# Altium schematic sheet SpeedACQ.SchDoc: SpeedACQ
size A4; Author: Joao Guimaraes; Organization: Altium Limited; Address1: L3, 12a Rodborough Rd; Address2: Frenchs Forest; Address3: NSW; Address4: Australia 2086; Revision: 1.0.0
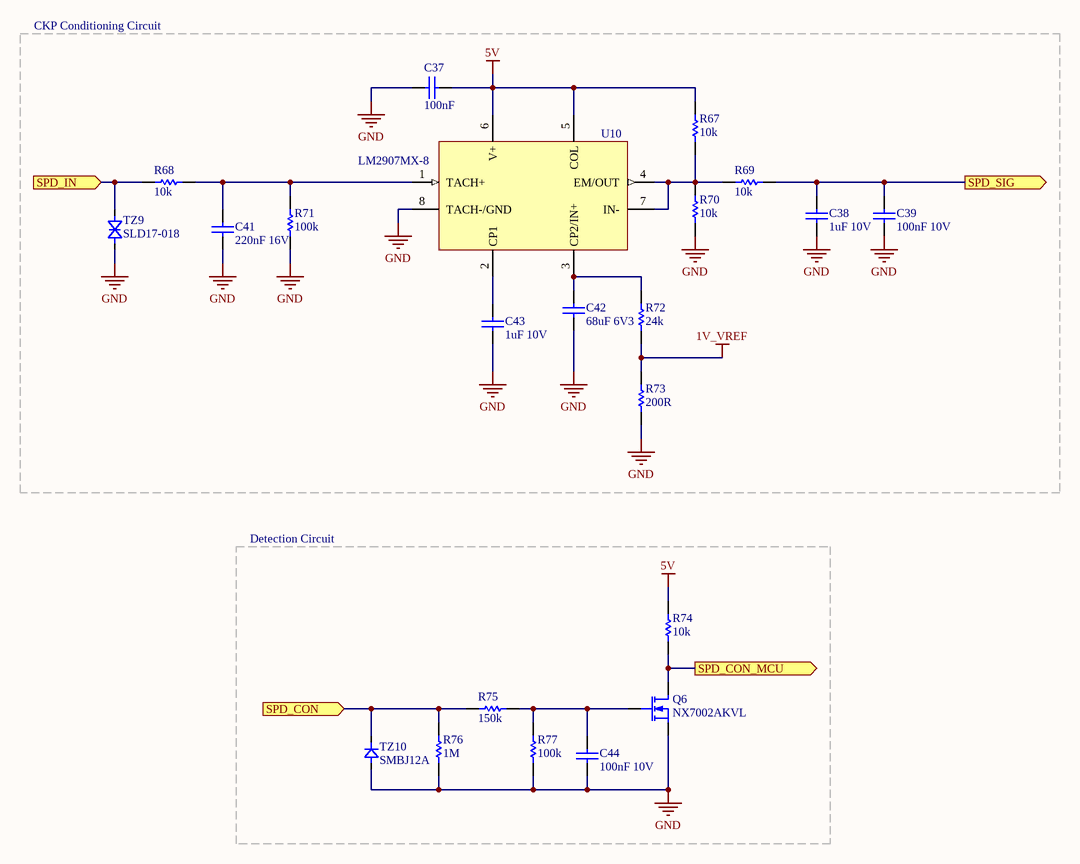
[diagram p0: SpeedACQ.SchDoc]

## Parts
C37  100nF  [0402]
C38  1uF 10V  [C0805]
C39  100nF 10V  [0402]
C41  220nF 16V  [0402]
C42  68uF 6V3  [C0805]
C43  1uF 10V  [C0805]
C44  100nF 10V  [0402]
Q6  NX7002AKVL  [SOT23_M]
R67  10k  [6-0805_M]
R68  10k  [6-0805_M]
R69  10k  [6-0805_M]
R70  10k  [6-0805_M]
R71  100k  [6-0805_M]
R72  24k  [6-0805_M]
R73  200R  [6-0805_M]
R74  10k  [6-0805_M]
R75  150k  [6-0805_M]
R76  1M  [6-0805_M]
R77  100k  [6-0805_M]
TZ9  SLD17-018  [PIN-W2/E2.8]
TZ10  SMBJ12A  [DO-214AA]
U10  LM2907MX-8  [SO8_M]

## Blocks framed on the sheet
CKP Conditioning Circuit: C37-C39 C41-C43 R67-R73 TZ9 U10
Detection Circuit: C44 Q6 R74-R77 TZ10

## Ports
SPD_CON (in), SPD_CON_MCU (out), SPD_IN (in), SPD_SIG (out)

## Nets
1V_VREF: R72.1 R73.2
5V: C37.2 R67.2 R74.2 U10.5(COL) U10.6(V+)
GND: C37.1 C38.1 C39.1 C41.1 C42.1 C43.1 C44.1 Q6.2(S) R70.1 R71.1 R73.1 R76.2 R77.1 TZ9.1(A) TZ10.1(A) U10.8(TACH-/GND)
SPD_CON: R75.1 R76.1 TZ10.2(C) ; port SPD_CON
SPD_CON_MCU: Q6.3(D) R74.1 ; port SPD_CON_MCU
SPD_IN: R68.1 TZ9.2(K) ; port SPD_IN
SPD_SIG: C38.2 C39.2 R69.2 ; port SPD_SIG
NetC41_2: C41.2 R68.2 R71.2 U10.1(TACH+)
NetC42_2: C42.2 R72.2 U10.3(CP2/IN+)
NetC43_2: C43.2 U10.2(CP1)
NetC44_2: C44.2 Q6.1(G) R75.2 R77.2
NetR67_1: R67.1 R69.1 R70.2 U10.4(EM/OUT) U10.7(IN-)

## Notes on the sheet
- Title:
- Project:
- Date:
- Author:
- Version:
- File:

## Library data of the parts
C37 C39 C44 = Cap: Capacitor; PartNumber: CAP.100n.10V.20%.SMD.0402; Manufacturer: Wurth; ClassName: SpeedACQ; Price: 0.015; Supplier: Mouser
C38 = Cap: Capacitor; PartNumber: CAP.1u.10V.5%.SMD.0805; Manufacturer: Vishay; ClassName: SpeedACQ; Price: 0.17; Supplier: Mouser
C41 = Cap: Capacitor; PartNumber: CAP.0.22u.16V.5%.SMD.0805; Manufacturer: Wurth; ClassName: SpeedACQ; Price: .10; Supplier: Mouser
C42 = Cap: Capacitor; PartNumber: CAP.68u.6V3.5%.SMD.0805; Manufacturer: Vishay; ClassName: SpeedACQ; Price: 0.88; Supplier: Mouser
C43 = Cap: Capacitor; PartNumber: CAP.1u.10V.10%.SMD.0805; Manufacturer: Vishay; ClassName: SpeedACQ; Price: 0.17; Supplier: Mouser
Q6 = NX7002AKVL: Small Signal MOSFET 60 V, 310 mA, Single, N−Channel, SOT−23; Manufacturer: Nexperia; ClassName: SpeedACQ; Price: 0.16; PartNumber: NX7002AKVL; Supplier: Mouser
R67-R70 R74 = Res: Resistor; PartNumber: RES.10K.1/8W.5%.SMD.0805; Manufacturer: Yageo; ClassName: SpeedACQ; Price: 0.012; Supplier: Mouser
R71 R77 = Res: Resistor; PartNumber: RES.100K.1/8W.5%.SMD.0805; Manufacturer: Yageo; ClassName: SpeedACQ; Price: 0.012; Supplier: Mouser
R72 = Res: Resistor; PartNumber: RES.24K.1/8W.5%.SMD.0805; Manufacturer: Vishay; ClassName: SpeedACQ; Price: 0.10; Supplier: Mouser
R73 = Res: Resistor; PartNumber: RES.200R.1/8W.1%.SMD.0805; Manufacturer: Vishay; ClassName: SpeedACQ; Price: 0.10; Supplier: Mouser
R75 = Res: Resistor; PartNumber: RES.150K.1/8W.5%.SMD.0805; Manufacturer: Vishay; ClassName: SpeedACQ; Price: 0.10; Supplier: Mouser
R76 = Res: Resistor; PartNumber: RES.1M.1/8W.5%.SMD.0805; Manufacturer: Bourns; ClassName: SpeedACQ; Price: 0.012; Supplier: Mouser
TZ9 = SLD30-018: TVS Bi-Directional VR=30V; Manufacturer: Littelfuse; ClassName: PowerSupplies; PartNumber: SLD17-018; Price: 3.17; Supplier: Mouser
TZ10 = SMBJ12A: ESD Suppressors / TVS Diodes 12V 600W SMB Unidirectional; pin to pad: 1>A 2>C; Manufacturer: ON Semiconductor; ClassName: SpeedACQ; Price: 0.37; PartNumber: SMBJ12A; Supplier: Mouser
U10 = LM2907MX-8: Voltage to Frequency & Frequency to Voltage Frequency to Voltage Converter; Manufacturer: Texas Instruments; ClassName: SpeedACQ; Price: 2.03; PartNumber: LM2907MX-8; Supplier: Mouser